# Altium schematic sheet 1_bootleg-4_top.SchDoc: waffling60 - PCB
size A4; Engineer: 4pplet; Revision: RevA; ProjectName: waffling60
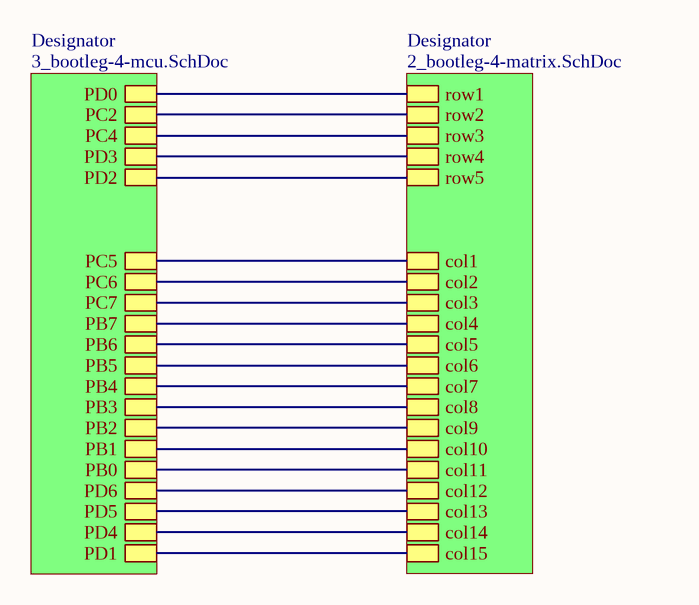
[diagram p0: 1_bootleg-4_top.SchDoc]

## Sub-sheets
Designator = 3_bootleg-4-mcu.SchDoc: PD3, PD0, PD1, PC2, PD2, PD4, PC4, PD5, PB5, PB6, PB4, PB2, PD6, PB3, PB1, PB0, PC7, PC5, PB7, PC6
Designator = 2_bootleg-4-matrix.SchDoc: col6, col8, col5, col7, col3, col2, col1, col4, col9, row3, row1, row4, row2, row5, col11, col10, col15, col13, col14, col12

## Nets
(unnamed): sheet Designator/PD3, sheet Designator/row4
(unnamed): sheet Designator/PD0, sheet Designator/row1
(unnamed): sheet Designator/PD1, sheet Designator/col15
(unnamed): sheet Designator/PC2, sheet Designator/row2
(unnamed): sheet Designator/PD2, sheet Designator/row5
(unnamed): sheet Designator/PD4, sheet Designator/col14
(unnamed): sheet Designator/PC4, sheet Designator/row3
(unnamed): sheet Designator/PD5, sheet Designator/col13
(unnamed): sheet Designator/PB5, sheet Designator/col6
(unnamed): sheet Designator/PB6, sheet Designator/col5
(unnamed): sheet Designator/PB4, sheet Designator/col7
(unnamed): sheet Designator/PB2, sheet Designator/col9
(unnamed): sheet Designator/PD6, sheet Designator/col12
(unnamed): sheet Designator/PB3, sheet Designator/col8
(unnamed): sheet Designator/PB1, sheet Designator/col10
(unnamed): sheet Designator/PB0, sheet Designator/col11
(unnamed): sheet Designator/PC7, sheet Designator/col3
(unnamed): sheet Designator/PC5, sheet Designator/col1
(unnamed): sheet Designator/PB7, sheet Designator/col4
(unnamed): sheet Designator/PC6, sheet Designator/col2